# EAGLE design Enclosure 85x58 PBL (EAGLE 9.6.2)
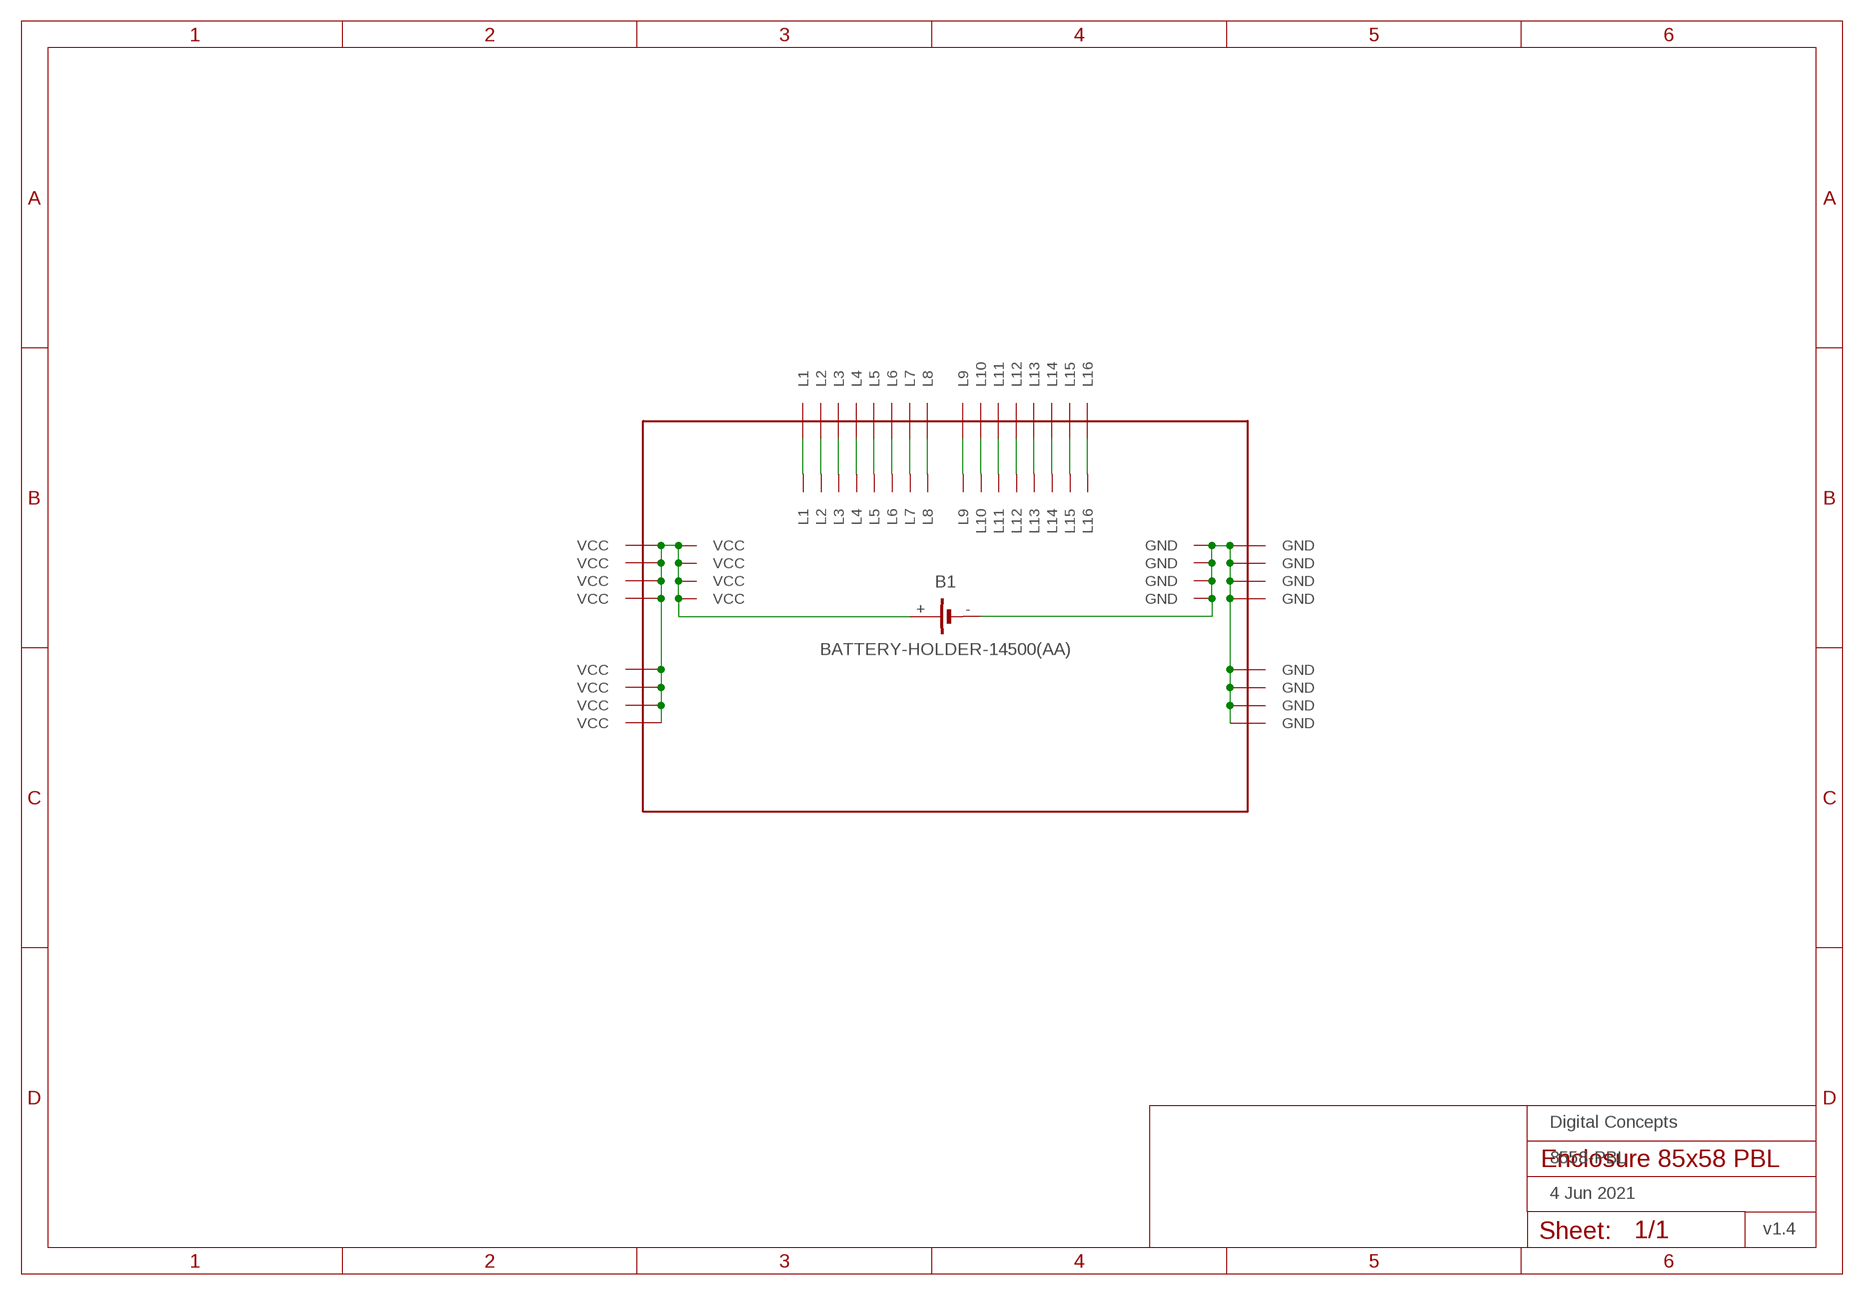
[diagram p0: schematic, sheet 1]
FRAME1 (FRAME-A4L-LOC): DATE: 4 Jun 2021; OWNER: Digital Concepts; TITLE: 8558-PBL; VERSION: v1.4

## Parts
B1  BATTERY-HOLDER-14500(AA)  [BATTERY-14500]
U$1  PROTO-28X18-BAT  [PROTO-28X18-BAT]

## Nets
GND: B1.- U$1.P27-12(GND) U$1.P27-13(GND) U$1.P27-14(GND) U$1.P27-15(GND) U$1.P28-04(GND) U$1.P28-05(GND) U$1.P28-06(GND) U$1.P28-07(GND) U$1.P28-12(GND) U$1.P28-13(GND) U$1.P28-14(GND) U$1.P28-15(GND)
N$4: U$1.P07-17(L1) U$1.P07-18(L1)
N$5: U$1.P08-17(L2) U$1.P08-18(L2)
N$6: U$1.P09-17(L3) U$1.P09-18(L3)
N$7: U$1.P10-17(L4) U$1.P10-18(L4)
N$8: U$1.P11-17(L5) U$1.P11-18(L5)
N$9: U$1.P12-17(L6) U$1.P12-18(L6)
N$10: U$1.P13-17(L7) U$1.P13-18(L7)
N$11: U$1.P14-17(L8) U$1.P14-18(L8)
N$12: U$1.P15-17(L9) U$1.P15-18(L9)
N$13: U$1.P16-17(L10) U$1.P16-18(L10)
N$14: U$1.P17-17(L11) U$1.P17-18(L11)
N$15: U$1.P18-17(L12) U$1.P18-18(L12)
N$16: U$1.P19-17(L13) U$1.P19-18(L13)
N$17: U$1.P20-17(L14) U$1.P20-18(L14)
N$18: U$1.P21-17(L15) U$1.P21-18(L15)
N$19: U$1.P22-17(L16) U$1.P22-18(L16)
VCC: B1.+ U$1.P01-04(VCC) U$1.P01-05(VCC) U$1.P01-06(VCC) U$1.P01-07(VCC) U$1.P01-12(VCC) U$1.P01-13(VCC) U$1.P01-14(VCC) U$1.P01-15(VCC) U$1.P02-12(VCC) U$1.P02-13(VCC) U$1.P02-14(VCC) U$1.P02-15(VCC)

## Library data of the parts
B1 = digitalconcepts:BATTERY-HOLDER-14500(AA): 14500 (AA) battery holder
U$1 = digitalconcepts:PROTO-28X18-BAT: 28 x 18 Prototyping board, with battery connection (GND + Vcc plane) and coupled side connection points, to fit an 85 x 58 enclosure

## Board
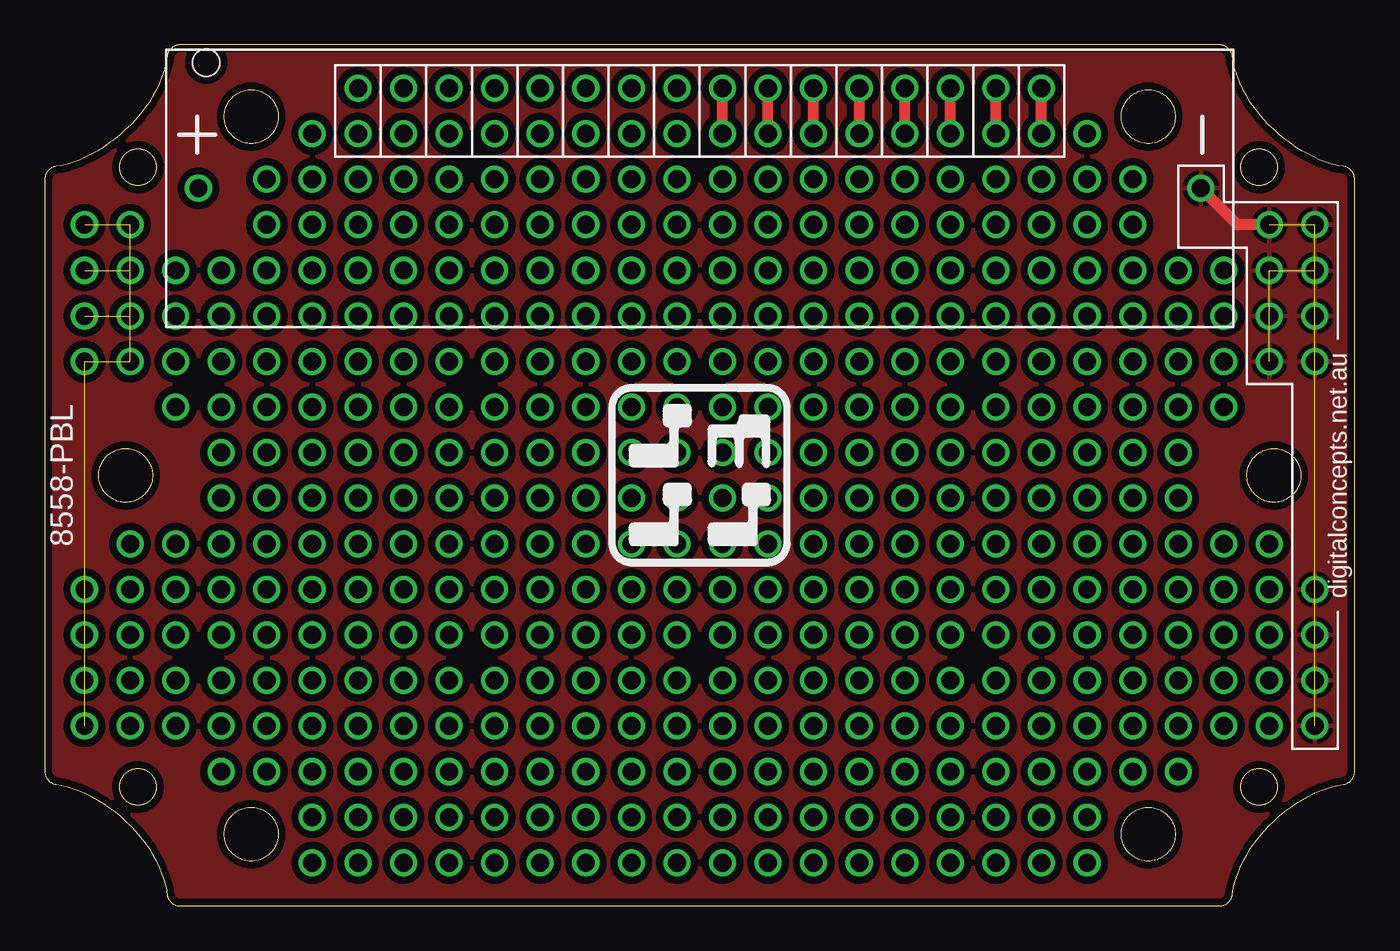
[diagram p1: board, top side]
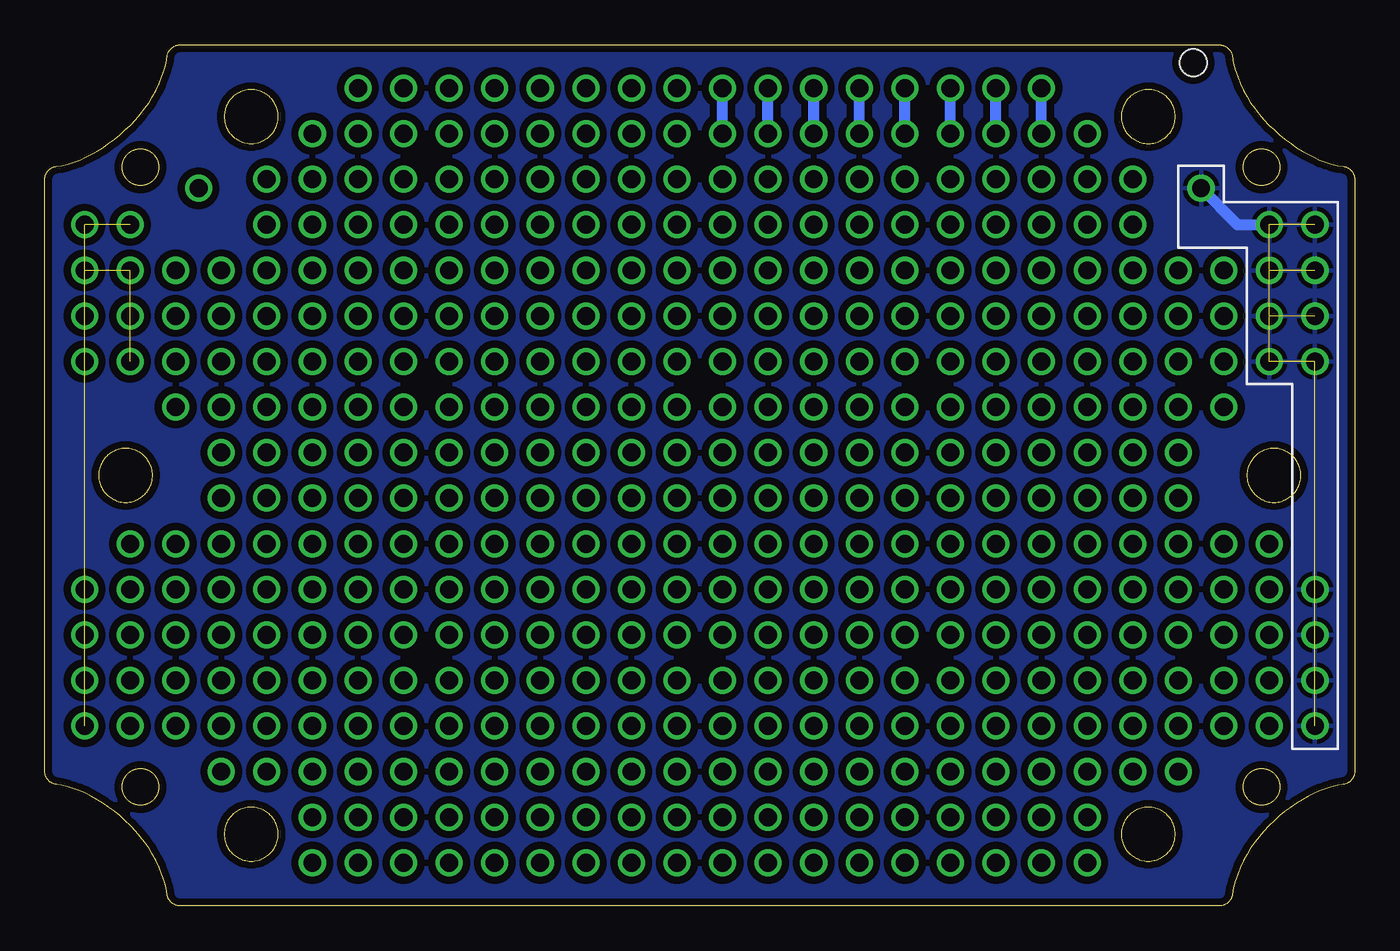
[diagram p2: board, bottom side, seen from below]

Size 73 x 48 mm. Coordinates in mm from the lower left corner, seen from the top.
Outline: 72.99,40.64 72.98,40.68 72.97,40.72 72.95,40.76 72.93,40.8 72.92,40.84 72.89,40.88 72.87,40.92 72.84,40.95 72.82,40.98 72.79,41.02 72.76,41.05 72.72,41.07 72.69,41.1 72.65,41.12 72.62,41.14 72.58,41.16 72.54,41.18 72.5,41.2 72.46,41.21 72.42,41.22 72.37,41.23 72.06,41.27 71.73,41.36 71.4,41.47 71.07,41.58 70.74,41.73 70.41,41.9 70.08,42.08 69.75,42.28 69.43,42.51 69.11,42.73 68.8,42.98 68.51,43.26 68.22,43.53 67.94,43.83 67.68,44.14 67.43,44.46 67.2,44.79 66.99,45.14 66.79,45.48 66.62,45.85 66.48,46.22 66.34,46.6 66.24,46.98 66.18,47.38 66.17,47.42 66.16,47.47 66.15,47.51 66.13,47.55 66.11,47.59 66.09,47.63 66.07,47.66 66.05,47.7 66.02,47.73 65.99,47.76 65.96,47.79 65.93,47.82 65.9,47.85 65.86,47.87 65.83,47.9 65.79,47.92 65.75,47.94 65.71,47.95 65.67,47.97 65.63,47.98 65.58,47.99 65.54,48 65.49,48 7.51,48 7.46,48 7.42,47.99 7.38,47.98 7.33,47.97 7.29,47.95 7.25,47.94 7.21,47.92 7.17,47.9 7.14,47.87 7.1,47.85 7.07,47.82 7.04,47.79 7.01,47.76 6.98,47.73 6.95,47.7 6.93,47.66 6.91,47.63 6.89,47.59 6.87,47.55 6.86,47.51 6.84,47.47 6.83,47.42 6.82,47.38 6.76,46.98 6.66,46.6 6.52,46.22 6.38,45.85 6.21,45.48 6.01,45.14 5.8,44.79 5.57,44.46 5.32,44.14 5.06,43.83 4.78,43.53 4.49,43.26 4.2,42.98 3.89,42.73 3.57,42.51 3.25,42.28 2.92,42.08 2.59,41.9 2.26,41.73 1.93,41.58 1.6,41.47 1.27,41.36 0.94,41.27 0.63,41.23 0.59,41.22 0.54,41.21 0.5,41.2 0.46,41.18 0.42,41.16 0.38,41.14 0.35,41.12 0.31,41.1 0.28,41.07 0.24,41.05 0.21,41.02 0.18,40.98 0.16,40.95 0.13,40.92 0.11,40.88 0.09,40.84 0.07,40.8 0.05,40.76 0.03,40.72 0.02,40.68 0.01,40.64 0,40.59 0,40.55 0,40.5 0,40.49 0,26.12 0,24.07 0,7.45 0,7.41 0.01,7.36 0.02,7.32 0.03,7.28 0.05,7.24 0.07,7.19 0.09,7.16 0.11,7.12 0.13,7.08 0.16,7.05 0.18,7.02 0.21,6.98 0.24,6.95 0.28,6.93 0.31,6.9 0.35,6.88 0.38,6.86 0.42,6.84 0.46,6.82 0.5,6.8 0.54,6.79 0.59,6.78 0.63,6.77 0.94,6.72 1.27,6.64 1.6,6.53 1.93,6.41 2.26,6.27 2.59,6.1 2.92,5.92 3.25,5.72 3.57,5.49 3.89,5.27 4.2,5.01 4.49,4.74 4.78,4.47 5.06,4.17 5.32,3.86 5.57,3.54 5.8,3.21 6.01,2.86 6.21,2.52 6.38,2.15 6.52,1.78 6.66,1.4 6.76,1.02 6.82,0.62 6.83,0.58 6.84,0.53 6.86,0.49 6.87,0.45 6.89,0.41 6.91,0.37 6.93,0.34 6.95,0.3 6.98,0.27 7.01,0.24 7.04,0.21 7.07,0.18 7.1,0.15 7.14,0.13 7.17,0.1 7.21,0.08 7.25,0.06 7.29,0.05 7.33,0.03 7.38,0.02 7.42,0.01 7.46,0 7.51,0 65.49,0 65.54,0 65.58,0.01 65.63,0.02 65.67,0.03 65.71,0.05 65.75,0.06 65.79,0.08 65.83,0.1 65.86,0.13 65.9,0.15 65.93,0.18 65.96,0.21 65.99,0.24 66.02,0.27 66.05,0.3 66.07,0.34 66.09,0.37 66.11,0.41 66.13,0.45 66.14,0.49 66.16,0.53 66.17,0.58 66.18,0.62 66.24,1.02 66.34,1.4 66.48,1.78 66.62,2.15 66.79,2.52 66.99,2.86 67.2,3.21 67.43,3.54 67.68,3.86 67.94,4.17 68.22,4.47 68.51,4.74 68.8,5.01 69.11,5.27 69.43,5.49 69.75,5.72 70.08,5.92 70.41,6.1 70.74,6.27 71.07,6.41 71.4,6.53 71.73,6.64 72.06,6.72 72.37,6.77 72.41,6.78 72.46,6.79 72.5,6.8 72.54,6.82 72.58,6.84 72.62,6.86 72.65,6.88 72.69,6.9 72.72,6.93 72.76,6.95 72.79,6.98 72.82,7.02 72.84,7.05 72.87,7.08 72.89,7.12 72.92,7.16 72.93,7.19 72.95,7.24 72.97,7.28 72.98,7.32 72.99,7.36 73,7.41 73,7.45 73,14.22 73,16.02 73,23.99 73,26.05 73,40.55 73,40.59 72.99,40.64
Outline: 5.97,23.7 5.95,23.6 5.92,23.51 5.88,23.42 5.84,23.33 5.8,23.24 5.74,23.16 5.69,23.08 5.63,23.01 5.56,22.94 5.49,22.87 5.42,22.81 5.34,22.76 5.26,22.7 5.17,22.66 5.08,22.62 4.99,22.58 4.9,22.55 4.8,22.53 4.7,22.51 4.6,22.5 4.4,22.5 4.3,22.51 4.2,22.53 4.1,22.55 4.01,22.58 3.92,22.62 3.83,22.66 3.74,22.7 3.66,22.76 3.58,22.81 3.51,22.87 3.44,22.94 3.37,23.01 3.31,23.08 3.26,23.16 3.2,23.24 3.16,23.33 3.12,23.42 3.08,23.51 3.05,23.6 3.03,23.7 3.01,23.8 3,23.9 3,24.1 3.01,24.2 3.03,24.3 3.05,24.4 3.08,24.49 3.12,24.58 3.16,24.67 3.2,24.76 3.26,24.84 3.31,24.92 3.37,24.99 3.51,25.13 3.58,25.19 3.66,25.24 3.74,25.3 3.83,25.34 3.92,25.38 4.01,25.42 4.1,25.45 4.2,25.47 4.3,25.49 4.4,25.5 4.6,25.5 4.7,25.49 4.8,25.47 4.9,25.45 4.99,25.42 5.08,25.38 5.17,25.34 5.26,25.3 5.34,25.24 5.42,25.19 5.49,25.13 5.63,24.99 5.69,24.92 5.74,24.84 5.8,24.76 5.84,24.67 5.88,24.58 5.92,24.49 5.95,24.4 5.97,24.3 5.99,24.2 6,24.1 6,23.9 5.99,23.8 5.97,23.7
Outline: 12.97,3.7 12.95,3.6 12.92,3.51 12.88,3.42 12.84,3.33 12.8,3.24 12.74,3.16 12.69,3.08 12.63,3.01 12.56,2.94 12.49,2.87 12.42,2.81 12.26,2.7 12.17,2.66 12.08,2.62 11.99,2.58 11.9,2.55 11.7,2.51 11.6,2.5 11.4,2.5 11.3,2.51 11.2,2.53 11.1,2.55 11.01,2.58 10.92,2.62 10.83,2.66 10.74,2.7 10.58,2.81 10.51,2.87 10.44,2.94 10.37,3.01 10.31,3.08 10.26,3.16 10.2,3.24 10.16,3.33 10.12,3.42 10.08,3.51 10.05,3.6 10.03,3.7 10.01,3.8 10,3.9 10,4.1 10.01,4.2 10.03,4.3 10.05,4.4 10.08,4.49 10.12,4.58 10.16,4.67 10.2,4.76 10.26,4.84 10.31,4.92 10.37,4.99 10.44,5.06 10.51,5.13 10.58,5.19 10.74,5.3 10.83,5.34 10.92,5.38 11.01,5.42 11.1,5.45 11.2,5.47 11.3,5.49 11.4,5.5 11.6,5.5 11.7,5.49 11.8,5.47 11.9,5.45 11.99,5.42 12.08,5.38 12.17,5.34 12.26,5.3 12.42,5.19 12.49,5.13 12.56,5.06 12.63,4.99 12.69,4.92 12.74,4.84 12.8,4.76 12.84,4.67 12.88,4.58 12.92,4.49 12.95,4.4 12.97,4.3 12.99,4.2 13,4.1 13,3.9 12.99,3.8 12.97,3.7
Outline: 12.97,43.7 12.95,43.6 12.92,43.51 12.88,43.42 12.84,43.33 12.8,43.24 12.74,43.16 12.69,43.08 12.63,43.01 12.49,42.87 12.42,42.81 12.34,42.76 12.26,42.7 12.17,42.66 12.08,42.62 11.99,42.58 11.9,42.55 11.8,42.53 11.7,42.51 11.6,42.5 11.4,42.5 11.3,42.51 11.2,42.53 11.1,42.55 11.01,42.58 10.83,42.66 10.74,42.7 10.66,42.76 10.58,42.81 10.51,42.87 10.44,42.94 10.37,43.01 10.31,43.08 10.26,43.16 10.2,43.24 10.16,43.33 10.12,43.42 10.08,43.51 10.05,43.6 10.03,43.7 10.01,43.8 10,43.9 10,44.1 10.01,44.2 10.03,44.3 10.05,44.4 10.08,44.49 10.12,44.58 10.16,44.67 10.2,44.76 10.26,44.84 10.31,44.92 10.37,44.99 10.44,45.06 10.51,45.13 10.58,45.19 10.66,45.24 10.74,45.3 10.83,45.34 10.92,45.38 11.01,45.42 11.1,45.45 11.2,45.47 11.3,45.49 11.4,45.5 11.6,45.5 11.7,45.49 11.8,45.47 11.9,45.45 11.99,45.42 12.08,45.38 12.17,45.34 12.26,45.3 12.42,45.19 12.49,45.13 12.56,45.06 12.63,44.99 12.69,44.92 12.74,44.84 12.8,44.76 12.84,44.67 12.88,44.58 12.92,44.49 12.95,44.4 12.97,44.3 12.99,44.2 13,44.1 13,43.9 12.99,43.8 12.97,43.7
Outline: 62.97,3.7 62.95,3.6 62.92,3.51 62.88,3.42 62.84,3.33 62.8,3.24 62.74,3.16 62.69,3.08 62.63,3.01 62.56,2.94 62.49,2.87 62.42,2.81 62.34,2.76 62.26,2.7 62.17,2.66 62.08,2.62 61.99,2.58 61.9,2.55 61.8,2.53 61.7,2.51 61.6,2.5 61.4,2.5 61.3,2.51 61.1,2.55 61.01,2.58 60.92,2.62 60.83,2.66 60.74,2.7 60.66,2.76 60.58,2.81 60.51,2.87 60.44,2.94 60.37,3.01 60.31,3.08 60.26,3.16 60.2,3.24 60.16,3.33 60.12,3.42 60.08,3.51 60.05,3.6 60.03,3.7 60.01,3.8 60,3.9 60,4.1 60.01,4.2 60.03,4.3 60.05,4.4 60.08,4.49 60.12,4.58 60.16,4.67 60.2,4.76 60.26,4.84 60.31,4.92 60.37,4.99 60.44,5.06 60.51,5.13 60.58,5.19 60.66,5.24 60.74,5.3 60.83,5.34 60.92,5.38 61.01,5.42 61.1,5.45 61.2,5.47 61.3,5.49 61.4,5.5 61.6,5.5 61.7,5.49 61.8,5.47 61.9,5.45 61.99,5.42 62.08,5.38 62.17,5.34 62.26,5.3 62.34,5.24 62.42,5.19 62.49,5.13 62.56,5.06 62.63,4.99 62.69,4.92 62.74,4.84 62.8,4.76 62.84,4.67 62.88,4.58 62.92,4.49 62.95,4.4 62.97,4.3 62.99,4.2 63,4.1 63,3.9 62.99,3.8 62.97,3.7
Outline: 62.97,43.7 62.95,43.6 62.92,43.51 62.88,43.42 62.84,43.33 62.8,43.24 62.74,43.16 62.69,43.08 62.63,43.01 62.56,42.94 62.49,42.87 62.42,42.81 62.34,42.76 62.26,42.7 62.17,42.66 62.08,42.62 61.99,42.58 61.9,42.55 61.7,42.51 61.6,42.5 61.4,42.5 61.3,42.51 61.1,42.55 61.01,42.58 60.92,42.62 60.83,42.66 60.74,42.7 60.66,42.76 60.58,42.81 60.51,42.87 60.37,43.01 60.31,43.08 60.26,43.16 60.2,43.24 60.16,43.33 60.12,43.42 60.08,43.51 60.05,43.6 60.03,43.7 60.01,43.8 60,43.9 60,44.1 60.01,44.2 60.05,44.4 60.08,44.49 60.12,44.58 60.16,44.67 60.2,44.76 60.26,44.84 60.31,44.92 60.37,44.99 60.44,45.06 60.51,45.13 60.58,45.19 60.66,45.24 60.74,45.3 60.83,45.34 60.92,45.38 61.01,45.42 61.1,45.45 61.2,45.47 61.3,45.49 61.4,45.5 61.6,45.5 61.7,45.49 61.8,45.47 61.9,45.45 61.99,45.42 62.08,45.38 62.17,45.34 62.26,45.3 62.34,45.24 62.42,45.19 62.49,45.13 62.56,45.06 62.63,44.99 62.69,44.92 62.74,44.84 62.8,44.76 62.84,44.67 62.88,44.58 62.92,44.49 62.95,44.4 62.99,44.2 63,44.1 63,43.9 62.99,43.8 62.97,43.7
Outline: 69.97,23.7 69.95,23.6 69.92,23.51 69.88,23.42 69.84,23.33 69.8,23.24 69.74,23.16 69.69,23.08 69.63,23.01 69.56,22.94 69.49,22.87 69.42,22.81 69.34,22.76 69.26,22.7 69.17,22.66 69.08,22.62 68.99,22.58 68.9,22.55 68.8,22.53 68.7,22.51 68.6,22.5 68.4,22.5 68.3,22.51 68.2,22.53 68.1,22.55 68.01,22.58 67.92,22.62 67.83,22.66 67.74,22.7 67.66,22.76 67.58,22.81 67.51,22.87 67.44,22.94 67.37,23.01 67.31,23.08 67.26,23.16 67.2,23.24 67.16,23.33 67.12,23.42 67.08,23.51 67.05,23.6 67.03,23.7 67.01,23.8 67,23.9 67,24.1 67.01,24.2 67.03,24.3 67.05,24.4 67.08,24.49 67.12,24.58 67.16,24.67 67.2,24.76 67.26,24.84 67.31,24.92 67.37,24.99 67.44,25.06 67.51,25.13 67.58,25.19 67.66,25.24 67.74,25.3 67.83,25.34 67.92,25.38 68.01,25.42 68.1,25.45 68.2,25.47 68.3,25.49 68.4,25.5 68.6,25.5 68.7,25.49 68.8,25.47 68.9,25.45 68.99,25.42 69.08,25.38 69.17,25.34 69.26,25.3 69.34,25.24 69.42,25.19 69.49,25.13 69.56,25.06 69.63,24.99 69.69,24.92 69.74,24.84 69.8,24.76 69.84,24.67 69.88,24.58 69.92,24.49 69.95,24.4 69.97,24.3 69.99,24.2 70,24.1 70,23.9 69.99,23.8 69.97,23.7
Outline: circle at 5.19,41.18 radius 1.02
Outline: circle at 5.19,6.64 radius 1.02
Outline: circle at 67.67,6.64 radius 1.02
Outline: circle at 67.67,41.18 radius 1.02
Copper layers (1*16): Top 0.035mm / dielectric 1.5mm / Bottom 0.035mm
Design rules "default *": minimum track width 6mil, minimum drill 0.35mm, track to track 6mil, track to pad 6mil, pad to pad 6mil, via to via 6mil, smd to smd 6mil, copper to edge 6mil, drill to drill 6mil, minimum pad ring 10mil, minimum via ring 8mil, stop-mask expansion 4mil, vias tented up to drill 0mil, thermal gap 10mil

### Footprints (pad centres in the part's own frame; a part is rotated, then mirrored left to right if it is on the bottom)
BATTERY-14500 = drill 1: + -27.94,0; - 27.94,0 | hole 1.524: -27.5,7
PROTO-28X18-BAT = drill 1: P01-04 -34.29,-13.97; P01-05 -34.29,-11.43; P01-06 -34.29,-8.89; P01-07 -34.29,-6.35; P01-12 -34.29,6.35; P01-13 -34.29,8.89; P01-14 -34.29,11.43; P01-15 -34.29,13.97; P02-04 -31.75,-13.97; P02-05 -31.75,-11.43; P02-06 -31.75,-8.89; P02-07 -31.75,-6.35; P02-08 -31.75,-3.81; P02-12 -31.75,6.35; P02-13 -31.75,8.89; P02-14 -31.75,11.43; P02-15 -31.75,13.97; P03-04 -29.21,-13.97; P03-05 -29.21,-11.43; P03-06 -29.21,-8.89; P03-07 -29.21,-6.35; P03-08 -29.21,-3.81; P03-11 -29.21,3.81; P03-12 -29.21,6.35; P03-13 -29.21,8.89; P03-14 -29.21,11.43; P04-03 -26.67,-16.51; P04-04 -26.67,-13.97; P04-05 -26.67,-11.43; P04-06 -26.67,-8.89; P04-07 -26.67,-6.35; P04-08 -26.67,-3.81; P04-09 -26.67,-1.27; P04-10 -26.67,1.27; P04-11 -26.67,3.81; P04-12 -26.67,6.35; P04-13 -26.67,8.89; P04-14 -26.67,11.43; P05-03 -24.13,-16.51; P05-04 -24.13,-13.97; P05-05 -24.13,-11.43; P05-06 -24.13,-8.89; P05-07 -24.13,-6.35; P05-08 -24.13,-3.81; P05-09 -24.13,-1.27; P05-10 -24.13,1.27; P05-11 -24.13,3.81; P05-12 -24.13,6.35; P05-13 -24.13,8.89; P05-14 -24.13,11.43; P05-15 -24.13,13.97; P05-16 -24.13,16.51; P06-01 -21.59,-21.59; P06-02 -21.59,-19.05; P06-03 -21.59,-16.51; P06-04 -21.59,-13.97; P06-05 -21.59,-11.43; P06-06 -21.59,-8.89; P06-07 -21.59,-6.35; P06-08 -21.59,-3.81; P06-09 -21.59,-1.27; P06-10 -21.59,1.27; P06-11 -21.59,3.81; P06-12 -21.59,6.35; P06-13 -21.59,8.89; P06-14 -21.59,11.43; P06-15 -21.59,13.97; P06-16 -21.59,16.51; P06-17 -21.59,19.05; P07-01 -19.05,-21.59; P07-02 -19.05,-19.05; P07-03 -19.05,-16.51; P07-04 -19.05,-13.97; P07-05 -19.05,-11.43; P07-06 -19.05,-8.89; P07-07 -19.05,-6.35; P07-08 -19.05,-3.81; P07-09 -19.05,-1.27; P07-10 -19.05,1.27; P07-11 -19.05,3.81; P07-12 -19.05,6.35; P07-13 -19.05,8.89; P07-14 -19.05,11.43; P07-15 -19.05,13.97; P07-16 -19.05,16.51; P07-17 -19.05,19.05; P07-18 -19.05,21.59; P08-01 -16.51,-21.59; P08-02 -16.51,-19.05; P08-03 -16.51,-16.51; P08-04 -16.51,-13.97; P08-05 -16.51,-11.43; P08-06 -16.51,-8.89; P08-07 -16.51,-6.35; P08-08 -16.51,-3.81; P08-09 -16.51,-1.27; P08-10 -16.51,1.27; P08-11 -16.51,3.81; P08-12 -16.51,6.35; P08-13 -16.51,8.89; P08-14 -16.51,11.43; P08-15 -16.51,13.97; P08-16 -16.51,16.51; P08-17 -16.51,19.05; P08-18 -16.51,21.59; P09-01 -13.97,-21.59; P09-02 -13.97,-19.05; P09-03 -13.97,-16.51; P09-04 -13.97,-13.97; P09-05 -13.97,-11.43; P09-06 -13.97,-8.89; P09-07 -13.97,-6.35; P09-08 -13.97,-3.81; P09-09 -13.97,-1.27; P09-10 -13.97,1.27; P09-11 -13.97,3.81; P09-12 -13.97,6.35; P09-13 -13.97,8.89; P09-14 -13.97,11.43; P09-15 -13.97,13.97; P09-16 -13.97,16.51; P09-17 -13.97,19.05; P09-18 -13.97,21.59; P10-01 -11.43,-21.59; P10-02 -11.43,-19.05; P10-03 -11.43,-16.51; P10-04 -11.43,-13.97; P10-05 -11.43,-11.43; P10-06 -11.43,-8.89; P10-07 -11.43,-6.35; P10-08 -11.43,-3.81; P10-09 -11.43,-1.27; P10-10 -11.43,1.27; P10-11 -11.43,3.81; P10-12 -11.43,6.35; P10-13 -11.43,8.89; P10-14 -11.43,11.43; P10-15 -11.43,13.97; P10-16 -11.43,16.51; P10-17 -11.43,19.05; P10-18 -11.43,21.59; P11-01 -8.89,-21.59; P11-02 -8.89,-19.05; P11-03 -8.89,-16.51; P11-04 -8.89,-13.97; P11-05 -8.89,-11.43; P11-06 -8.89,-8.89; P11-07 -8.89,-6.35; P11-08 -8.89,-3.81; P11-09 -8.89,-1.27; P11-10 -8.89,1.27; P11-11 -8.89,3.81; P11-12 -8.89,6.35; P11-13 -8.89,8.89; P11-14 -8.89,11.43; P11-15 -8.89,13.97; P11-16 -8.89,16.51; P11-17 -8.89,19.05; P11-18 -8.89,21.59; P12-01 -6.35,-21.59; P12-02 -6.35,-19.05; P12-03 -6.35,-16.51; P12-04 -6.35,-13.97; P12-05 -6.35,-11.43; P12-06 -6.35,-8.89; P12-07 -6.35,-6.35; P12-08 -6.35,-3.81; P12-09 -6.35,-1.27; P12-10 -6.35,1.27; P12-11 -6.35,3.81; P12-12 -6.35,6.35; P12-13 -6.35,8.89; P12-14 -6.35,11.43; P12-15 -6.35,13.97; P12-16 -6.35,16.51; P12-17 -6.35,19.05; P12-18 -6.35,21.59; P13-01 -3.81,-21.59; P13-02 -3.81,-19.05; P13-03 -3.81,-16.51; P13-04 -3.81,-13.97; P13-05 -3.81,-11.43; P13-06 -3.81,-8.89; P13-07 -3.81,-6.35; P13-08 -3.81,-3.81; P13-09 -3.81,-1.27; P13-10 -3.81,1.27; P13-11 -3.81,3.81; P13-12 -3.81,6.35; P13-13 -3.81,8.89; P13-14 -3.81,11.43; P13-15 -3.81,13.97; P13-16 -3.81,16.51; P13-17 -3.81,19.05; P13-18 -3.81,21.59; P14-01 -1.27,-21.59; P14-02 -1.27,-19.05; P14-03 -1.27,-16.51; P14-04 -1.27,-13.97; P14-05 -1.27,-11.43; P14-06 -1.27,-8.89; P14-07 -1.27,-6.35; P14-08 -1.27,-3.81; P14-09 -1.27,-1.27; P14-10 -1.27,1.27; P14-11 -1.27,3.81; P14-12 -1.27,6.35; P14-13 -1.27,8.89; P14-14 -1.27,11.43; P14-15 -1.27,13.97; P14-16 -1.27,16.51; P14-17 -1.27,19.05; P14-18 -1.27,21.59; P15-01 1.27,-21.59; P15-02 1.27,-19.05; P15-03 1.27,-16.51; P15-04 1.27,-13.97; P15-05 1.27,-11.43; P15-06 1.27,-8.89; P15-07 1.27,-6.35; P15-08 1.27,-3.81; P15-09 1.27,-1.27; P15-10 1.27,1.27; P15-11 1.27,3.81; P15-12 1.27,6.35; P15-13 1.27,8.89; P15-14 1.27,11.43; P15-15 1.27,13.97; P15-16 1.27,16.51; P15-17 1.27,19.05; P15-18 1.27,21.59; P16-01 3.81,-21.59; P16-02 3.81,-19.05; P16-03 3.81,-16.51; P16-04 3.81,-13.97; P16-05 3.81,-11.43; P16-06 3.81,-8.89; P16-07 3.81,-6.35; P16-08 3.81,-3.81; P16-09 3.81,-1.27; P16-10 3.81,1.27; P16-11 3.81,3.81; P16-12 3.81,6.35; P16-13 3.81,8.89; P16-14 3.81,11.43; P16-15 3.81,13.97; P16-16 3.81,16.51; P16-17 3.81,19.05; P16-18 3.81,21.59; P17-01 6.35,-21.59; P17-02 6.35,-19.05; P17-03 6.35,-16.51; P17-04 6.35,-13.97; P17-05 6.35,-11.43; P17-06 6.35,-8.89; P17-07 6.35,-6.35; P17-08 6.35,-3.81; P17-09 6.35,-1.27; P17-10 6.35,1.27; P17-11 6.35,3.81; P17-12 6.35,6.35; P17-13 6.35,8.89; P17-14 6.35,11.43; P17-15 6.35,13.97; P17-16 6.35,16.51; P17-17 6.35,19.05; P17-18 6.35,21.59; P18-01 8.89,-21.59; P18-02 8.89,-19.05; P18-03 8.89,-16.51; P18-04 8.89,-13.97; P18-05 8.89,-11.43; P18-06 8.89,-8.89; P18-07 8.89,-6.35; P18-08 8.89,-3.81; P18-09 8.89,-1.27; P18-10 8.89,1.27; P18-11 8.89,3.81; P18-12 8.89,6.35; P18-13 8.89,8.89; P18-14 8.89,11.43; P18-15 8.89,13.97; P18-16 8.89,16.51; P18-17 8.89,19.05; P18-18 8.89,21.59; P19-01 11.43,-21.59; P19-02 11.43,-19.05; P19-03 11.43,-16.51; P19-04 11.43,-13.97; P19-05 11.43,-11.43; P19-06 11.43,-8.89; P19-07 11.43,-6.35; P19-08 11.43,-3.81; P19-09 11.43,-1.27; P19-10 11.43,1.27; P19-11 11.43,3.81; P19-12 11.43,6.35; P19-13 11.43,8.89; P19-14 11.43,11.43; P19-15 11.43,13.97; P19-16 11.43,16.51; P19-17 11.43,19.05; P19-18 11.43,21.59; P20-01 13.97,-21.59; P20-02 13.97,-19.05; P20-03 13.97,-16.51; P20-04 13.97,-13.97; P20-05 13.97,-11.43; P20-06 13.97,-8.89; P20-07 13.97,-6.35; P20-08 13.97,-3.81; P20-09 13.97,-1.27; P20-10 13.97,1.27; P20-11 13.97,3.81; P20-12 13.97,6.35; P20-13 13.97,8.89; P20-14 13.97,11.43; P20-15 13.97,13.97; P20-16 13.97,16.51; P20-17 13.97,19.05; P20-18 13.97,21.59; P21-01 16.51,-21.59; P21-02 16.51,-19.05; P21-03 16.51,-16.51; P21-04 16.51,-13.97; P21-05 16.51,-11.43; P21-06 16.51,-8.89; P21-07 16.51,-6.35; P21-08 16.51,-3.81; P21-09 16.51,-1.27; P21-10 16.51,1.27; P21-11 16.51,3.81; P21-12 16.51,6.35; P21-13 16.51,8.89; P21-14 16.51,11.43; P21-15 16.51,13.97; P21-16 16.51,16.51; P21-17 16.51,19.05; P21-18 16.51,21.59; P22-01 19.05,-21.59; P22-02 19.05,-19.05; P22-03 19.05,-16.51; P22-04 19.05,-13.97; P22-05 19.05,-11.43; P22-06 19.05,-8.89; P22-07 19.05,-6.35; P22-08 19.05,-3.81; P22-09 19.05,-1.27; P22-10 19.05,1.27; P22-11 19.05,3.81; P22-12 19.05,6.35; P22-13 19.05,8.89; P22-14 19.05,11.43; P22-15 19.05,13.97; P22-16 19.05,16.51; P22-17 19.05,19.05; P22-18 19.05,21.59; P23-01 21.59,-21.59; P23-02 21.59,-19.05; P23-03 21.59,-16.51; P23-04 21.59,-13.97; P23-05 21.59,-11.43; P23-06 21.59,-8.89; P23-07 21.59,-6.35; P23-08 21.59,-3.81; P23-09 21.59,-1.27; P23-10 21.59,1.27; P23-11 21.59,3.81; P23-12 21.59,6.35; P23-13 21.59,8.89; P23-14 21.59,11.43; P23-15 21.59,13.97; P23-16 21.59,16.51; P23-17 21.59,19.05; P24-03 24.13,-16.51; P24-04 24.13,-13.97; P24-05 24.13,-11.43; P24-06 24.13,-8.89; P24-07 24.13,-6.35; P24-08 24.13,-3.81; P24-09 24.13,-1.27; P24-10 24.13,1.27; P24-11 24.13,3.81; P24-12 24.13,6.35; P24-13 24.13,8.89; P24-14 24.13,11.43; P24-15 24.13,13.97; P24-16 24.13,16.51; P25-03 26.67,-16.51; P25-04 26.67,-13.97; P25-05 26.67,-11.43; P25-06 26.67,-8.89; P25-07 26.67,-6.35; P25-08 26.67,-3.81; P25-09 26.67,-1.27; P25-10 26.67,1.27; P25-11 26.67,3.81; P25-12 26.67,6.35; P25-13 26.67,8.89; P25-14 26.67,11.43; P26-04 29.21,-13.97; P26-05 29.21,-11.43; P26-06 29.21,-8.89; P26-07 29.21,-6.35; P26-08 29.21,-3.81; P26-11 29.21,3.81; P26-12 29.21,6.35; P26-13 29.21,8.89; P26-14 29.21,11.43; P27-04 31.75,-13.97; P27-05 31.75,-11.43; P27-06 31.75,-8.89; P27-07 31.75,-6.35; P27-08 31.75,-3.81; P27-12 31.75,6.35; P27-13 31.75,8.89; P27-14 31.75,11.43; P27-15 31.75,13.97; P28-04 34.29,-13.97; P28-05 34.29,-11.43; P28-06 34.29,-8.89; P28-07 34.29,-6.35; P28-12 34.29,6.35; P28-13 34.29,8.89; P28-14 34.29,11.43; P28-15 34.29,13.97

### Placement (x,y rotation side)
B1  36.5,40 0 top
U$1  36.5,24 0 top

### Tracks (layer width: path | path; a pad name or v marks a point on that pad's centre or on a via)
GND  (11 unrouted)
  Top 0.61: U$1.P27-15 66.47,37.97 B1.-
  pour Top (isolate 0.406): -1.6,50.03 75.11,50.03 75.11,-1.78 -1.6,-1.78
N$4
  Bottom 0.6: U$1.P07-17 U$1.P07-18
N$5
  Bottom 0.6: U$1.P08-17 U$1.P08-18
N$6
  Bottom 0.6: U$1.P09-17 U$1.P09-18
N$7
  Bottom 0.6: U$1.P10-17 U$1.P10-18
N$8
  Bottom 0.6: U$1.P11-17 U$1.P11-18
N$9
  Bottom 0.6: U$1.P12-17 U$1.P12-18
N$10
  Bottom 0.6: U$1.P13-17 U$1.P13-18
N$11
  Bottom 0.6: U$1.P14-17 U$1.P14-18
N$12
  Top 0.6: U$1.P15-17 U$1.P15-18
N$13
  Top 0.6: U$1.P16-17 U$1.P16-18
N$14
  Top 0.6: U$1.P17-17 U$1.P17-18
N$15
  Top 0.6: U$1.P18-17 U$1.P18-18
N$16
  Top 0.6: U$1.P19-17 U$1.P19-18
N$17
  Top 0.6: U$1.P20-17 U$1.P20-18
N$18
  Top 0.6: U$1.P21-17 U$1.P21-18
N$19
  Top 0.6: U$1.P22-17 U$1.P22-18
VCC  (11 unrouted)
  Bottom 0.61: B1.+ 6.53,37.97 U$1.P02-15
  pour Bottom (isolate 0.406): -0.33,48.76 73.84,48.76 73.84,-0.51 -0.33,-0.51

### Text on the board
tPlace: 8558-PBL | digitalconcepts.net.au